# EasyEDA Pro project ProProject_Access Control AC Power Switch_2024-06-07.epro, schematic V2.0.1 Power Relay Schematic
Create Date: 2024-05-01; Page Name: P1; Project Name: Access Control V2; Schematic Name: V2.0.1 Power Relay Schematic; Update Date: 2024-05-10; Company: EasyEDA.com; Drawn: EasyEDA; Page Size: A4; Part Number: JLCPCB-002; Reviewed: EasyEDA; Version: V0.1
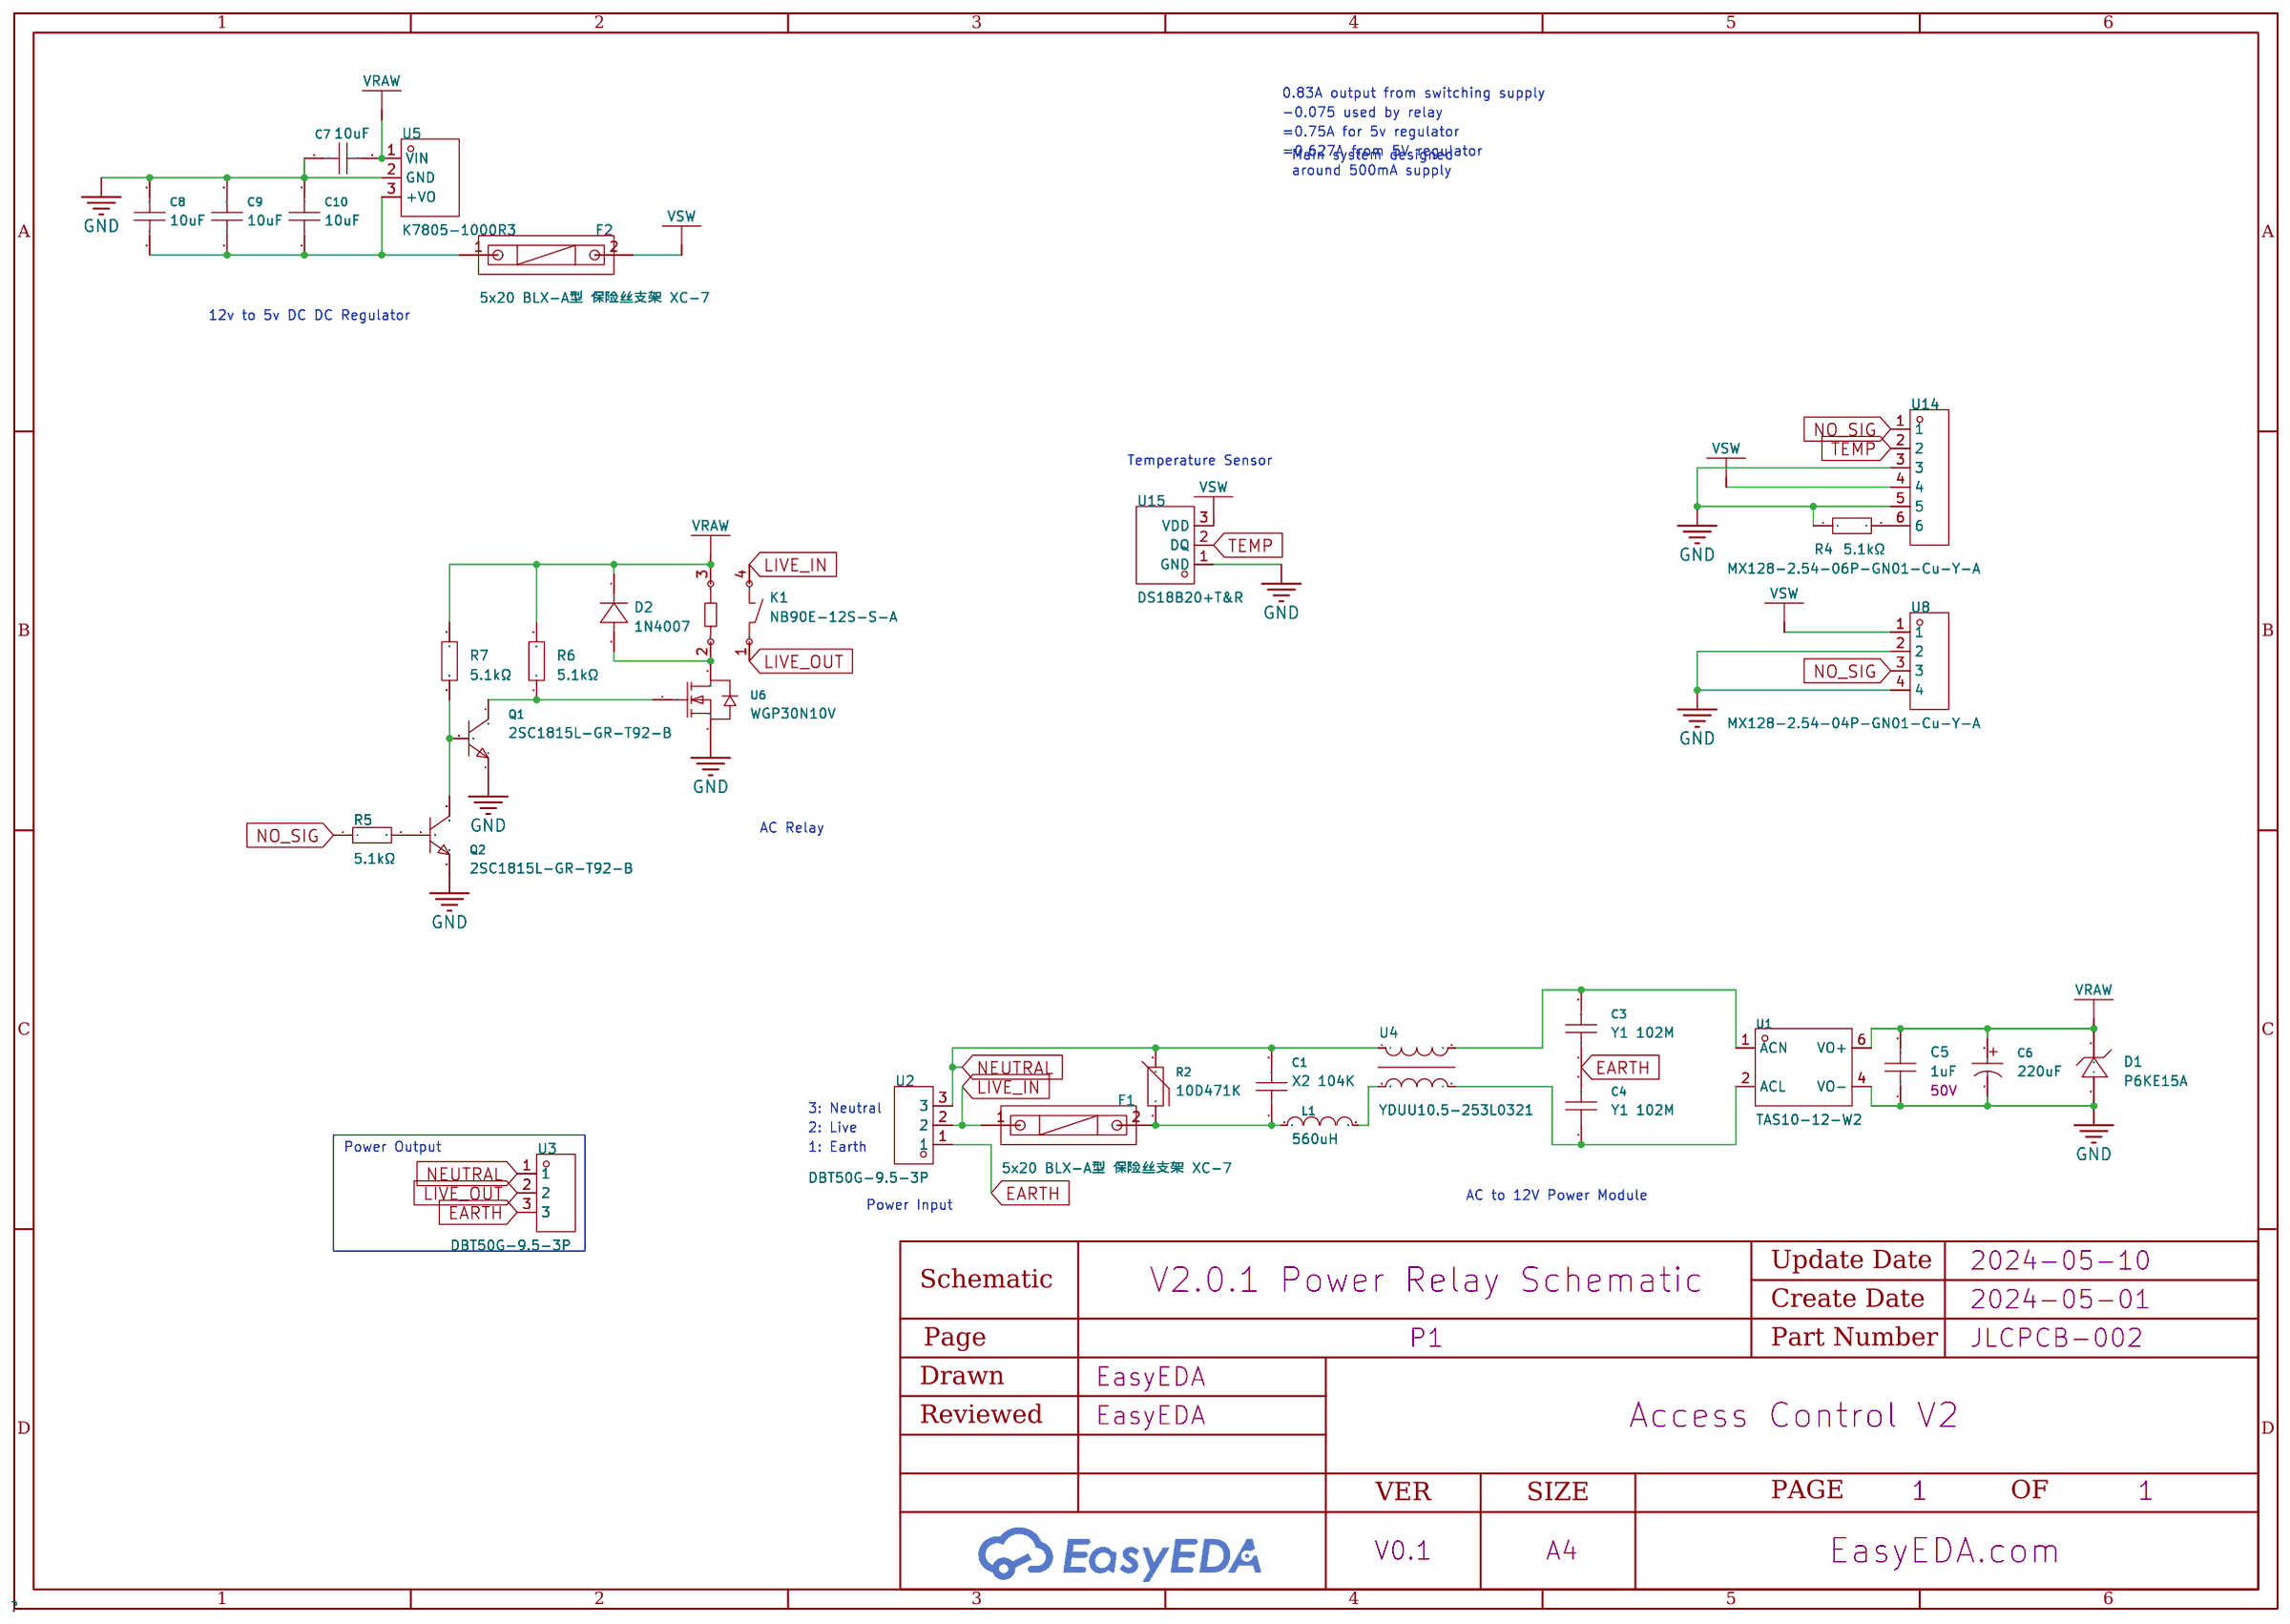
[diagram p0: schematic sheet]

## Parts
C1  100nF  [CAP-TH_L10.0-W5.0-P7.50-D0.6]
C3  1nF  [CAP-TH_L8.5-W5.0-P10.00-D0.6]
C4  1nF  [CAP-TH_L8.5-W5.0-P10.00-D0.6]
C5  1uF  [CAP-TH_L5.5-W3.5-P5.00-D1.2]
C6  220uF  [CAP-TH_BD6.3-P2.50-D1.0-FD]
C7  10uF  [CAP-TH_L5.5-W3.8-P3.50-D0.6]
C8  10uF  [CAP-TH_L5.5-W3.8-P3.50-D0.6]
C9  10uF  [CAP-TH_L5.5-W3.8-P3.50-D0.6]
C10  10uF  [CAP-TH_L5.5-W3.8-P3.50-D0.6]
D1  P6KE15A  [DO-15_BD3.2-L6.4-P10.40-D0.8-RD]
D2  1N4007  [DO-41_BD2.4-L4.7-P8.70-D0.8-RD]
F1  5x20 BLX-A型 保险丝支架 XC-7  [FUSE-TH_L22.6-W9.0]
F2  5x20 BLX-A型 保险丝支架 XC-7  [FUSE-TH_L22.6-W9.0]
K1  NB90E-12S-S-A  [RELAY-TH_NB90E-XXS-S-A]
L1  560uH  [IND-TH_BD9.0-P5.00-D0.7]
Q1  2SC1815L-GR-T92-B  [TO-92-3_L4.9-W3.7-P2.54-L]
Q2  2SC1815L-GR-T92-B  [TO-92-3_L4.9-W3.7-P2.54-L]
R2  10D471K  [RES-TH_L12.5-W6.7-P7.50-D1.2]
R4  5.1kΩ  [RES-TH_BD2.3-L6.5-P10.50-D0.5]
R5  5.1kΩ  [RES-TH_BD2.3-L6.5-P10.50-D0.5]
R6  5.1kΩ  [RES-TH_BD2.3-L6.5-P10.50-D0.5]
R7  5.1kΩ  [RES-TH_BD2.3-L6.5-P10.50-D0.5]
U1  TAS10-12-W2  [PWRM-TH_TAS10-XX-W2]
U2  DBT50G-9.5-3P  [CONN-TH_3P-P9.50_DBT50G-9.5-3P]
U3  DBT50G-9.5-3P  [CONN-TH_3P-P9.50_DBT50G-9.5-3P]
U4  YDUU10.5-253L0321  [IND-TH_4P-L19.0-W17.0]
U5  K7805-1000R3  [PWRM-TH_YLPTEC_K78XX-1000R3]
U6  WGP30N10V  [TO-220-3_L10.0-W4.6-P2.54-L]
U8  MX128-2.54-04P-GN01-Cu-Y-A  [CONN-TH_4P-P2.54_MX128-2.54-GN01-04P-CU-Y-A]
U14  MX128-2.54-06P-GN01-Cu-Y-A  [CONN-TH_6P-P2.54_MX128-2.54-6P]
U15  DS18B20+T&R  [TO-92-3_L4.9-W3.7-P2.54-L]

## Library data of the parts
C1 = PX104K2C0702: Capacitance: Tolerance:±10% Tolerance:±10% Voltage(AC):310V；380V；350V Subclass: Operating Temperature:-40℃~+110℃ Operating Temperature:-40℃~+110℃; LCSC Part Name: 等级:X2 100nF ±10% 310V 350V 380V; Supplier Part: C2693793; Manufacturer: KYET(科雅); Supplier Footprint: 插件,P=7.5mm; JLCPCB Part Class: Extended Part; Datasheet: https://atta.szlcsc.com/upload/public/pdf/source/20230824/212A883DA7F3524E26A294E17BC5A0F4.pdf; Supplier: LCSC; Tolerance: ±10%; Voltage(AC): 310V；380V；350V; Operating Temperature: -40℃~+110℃
C3 C4 = VY1102M31Y5UC63V0: Capacitance: Tolerance:±20% Tolerance:±20% Voltage(AC):760V Subclass: Operating Temperature:-40℃~+125℃ Operating Temperature:-40℃~+125℃; LCSC Part Name: 等级:X1,Y1 1nF ±20% 760V; Supplier Part: C1620957; Manufacturer: VISHAY(威世); Supplier Footprint: 插件,P=10mm; JLCPCB Part Class: Extended Part; Datasheet: https://atta.szlcsc.com/upload/public/pdf/source/20210503/4C6D9DFEC0766624DBEA7F26F929BB18.pdf; Supplier: LCSC; Tolerance: ±20%; Voltage(AC): 760V; Operating Temperature: -40℃~+125℃
C5 = FK26X7R1H105KRE06: Capacitance: Tolerance:±10% Tolerance:±10% Voltage Rated: Lead Spacing: Temperature Coefficient:; LCSC Part Name: 1uF ±10% 50V; Supplier Part: C2839237; Manufacturer: TDK; Supplier Footprint: 插件,P=5mm; JLCPCB Part Class: Extended Part; Datasheet: https://atta.szlcsc.com/upload/public/pdf/source/20211011/CA0C243CD946D294CDFF83D03DB16AD9.pdf; Supplier: LCSC; Tolerance: ±10%; Voltage Rated: 50V
C6 = KM227M025E11RR0VH2FP0: Capacitance:220uF Tolerance:±20% Tolerance:±20% Rated Voltage: Ripple Current:- Equivalent Series Resistance(ESR):- Lead Spacing: φD: L: Lifetime @ Temp:1000hrs@105℃; LCSC Part Name: 220uF ±20% 25V; Supplier Part: C12450; Manufacturer: CX(承兴); Supplier Footprint: 插件,D6.3xL11mm; JLCPCB Part Class: Extended Part; Datasheet: https://atta.szlcsc.com/upload/public/pdf/source/20211027/06D6BA3719C264B639DC286D935D03EA.pdf; Supplier: LCSC; Tolerance: ±20%; Lifetime @ Temp: 1000hrs@105℃
C7-C10 = CD1E106MC9BER2F100: Capacitance:10uF Tolerance:±20% Tolerance:±20% Voltage Rated: Temperature Coefficient:; LCSC Part Name: 10uF ±20% 25V; Supplier Part: C2761733; Manufacturer: Dersonic(德尔创); Supplier Footprint: 插件,P=5.08mm; JLCPCB Part Class: Extended Part; Datasheet: https://atta.szlcsc.com/upload/public/pdf/source/20210512/C2761733_48A4F8FFA54EF14BEC181E01EC41507A.pdf; Supplier: LCSC; Tolerance: ±20%
D1 = P6KE15A_C1974865: polarity:Unidirectional Reverse Stand-Off Voltage (Vrwm):12.8V Maximum Clamping Voltage:21.2V Peak Pulse Current (Ipp)@10/1000us:28.8A Peak Pulse Power Dissipation (Ppp)@10/1000us:600W Breakdown Voltage:14.3V Type:TVS; LCSC Part Name: TVS 12.8V截止 28.8A峰值脉冲; Supplier Part: C1974865; Manufacturer: Littelfuse(美国力特); Supplier Footprint: DO-15(DO-204AC); JLCPCB Part Class: Extended Part; Datasheet: https://atta.szlcsc.com/upload/public/pdf/source/20210316/C2760121_CE745CC1535F4E7F6CA9D58EF9C8652B.pdf; Supplier: LCSC; polarity: Unidirectional; Reverse Stand-Off Voltage (Vrwm): 12.8V; Maximum Clamping Voltage: 21.2V; Peak Pulse Current (Ipp)@10/1000us: 28.8A; Peak Pulse Power Dissipation (Ppp)@10/1000us: 600W; Breakdown Voltage: 14.3V; Type: TVS
D2 = 1N4007_C2985028: Forward Voltage (Vf@If):1V@1A Reverse Voltage (Vr): Average Rectified Current (Io):; LCSC Part Name: 电压:1kV 电流:1A; Supplier Part: C2985028; Manufacturer: GOODWORK(固得沃克); Supplier Footprint: DO-41; JLCPCB Part Class: Extended Part; Datasheet: https://atta.szlcsc.com/upload/public/pdf/source/20210723/C2848669_ECFE0BC1B34B7BAAA686846FF0F306A7.pdf; Supplier: LCSC; Forward Voltage (Vf@If): 1V@1A
F1 F2 = 5x20 BLX-A型 保险丝支架 XC-7: Fuseholder Type:- Fuse Type:- Fuse Size:-; LCSC Part Name: 保险丝座 5x20 BLX-A型; Supplier Part: C3131; Manufacturer: xcfuse(旭程); JLCPCB Part Class: Extended Part; Datasheet: https://atta.szlcsc.com/upload/public/pdf/source/20160427/1461725215151.pdf; Supplier: LCSC
K1 = NB90E-12S-S-A: Coil Voltage:12V Contact Form:一组常开:1A(SPST-常开) Pin Number:- Contact Rating:- Maximum Switching Voltage:277V@AC；30V@DC Coil Rated Power:900mW Contact Material:AgSnO2 Maximum Switching Current:30A Coil Type:无极性-单线圈 Coil Resistance:160Ω Contact Resistance:10; LCSC Part Name: 12V继电器 单刀单掷-常开; Supplier Part: C396894; Manufacturer: NBC(宝橙); Supplier Footprint: 插件,27.2x32mm; JLCPCB Part Class: Extended Part; Datasheet: https://atta.szlcsc.com/upload/public/pdf/source/20190621/C396896_7BA89285BD2A8229CEB67C9FBB667B77.pdf; Supplier: LCSC; Coil Voltage: 12V; Contact Form: 一组常开:1A(SPST-常开); Maximum Switching Voltage: 277V@AC；30V@DC; Coil Rated Power: 900mW; Contact Material: AgSnO2; Maximum Switching Current: 30A; Coil Type: 无极性-单线圈; Coil Resistance: 160Ω; Contact Resistance: 100mΩ; Operate Time: 15ms; Release Time: 10ms; Operating Temperature: -55℃~+85℃
L1 = PK0810-561KB: Inductance: Tolerance:±10% Tolerance:±10% Rated Current: DC Resistance (DCR): Type:工字电感; LCSC Part Name: 560uH ±10%; Supplier Part: C122800; Manufacturer: SXN(顺翔诺); Supplier Footprint: 插件; JLCPCB Part Class: Extended Part; Datasheet: https://atta.szlcsc.com/upload/public/pdf/source/20210810/BA6D1DA7D4BCBB7C641BC97B42CFC6FF.pdf; Supplier: LCSC; Tolerance: ±10%; Type: 工字电感
Q1 Q2 = 2SC1815L-GR-T92-B: Transistor Type: Collector Current (Ic): Collector-Emitter Breakdown Voltage (Vceo): Power Dissipation (Pd):; LCSC Part Name: 耐压:50V 电流:150mA NPN hfe=200~400; Supplier Part: C73309; Manufacturer: UTC(友顺); Supplier Footprint: TO-92-2.54mm; JLCPCB Part Class: Extended Part; Datasheet: https://atta.szlcsc.com/upload/public/pdf/source/20170209/1486607344255.pdf; Supplier: LCSC
R2 = 10D471K_C8760: Varistor Voltage:423V~517V Varistor Voltage:423V~517V Clamping Voltage: Allowable Voltage (DC): Allowable Voltage (AC): Peak Current: Maximum Energy:42.3J Maximum Energy:42.3J Typical Capatitance:190pF@1kHz; LCSC Part Name: 钳位电压775V 42.3焦耳 插件压敏电阻; Supplier Part: C8760; Manufacturer: RUILON(瑞隆源); Supplier Footprint: 插件; JLCPCB Part Class: Extended Part; Datasheet: https://atta.szlcsc.com/upload/public/pdf/source/20160725/1469440740918.pdf; Supplier: LCSC; Varistor Voltage: 423V~517V; Maximum Energy: 42.3J; Typical Capatitance: 190pF@1kHz
R4-R7 = CF1/4W-5.1KΩ±5% T: Type:Carbon Resister Resistance: Tolerance:±5% Tolerance:±5% Overload Voltage (Max):250V Power(Watts):250mW Temperature Coefficient:±350ppm/℃ Temperature Coefficient:±350ppm/℃ Operating Temperature Range:-55℃~+155℃ Operating Temperature Range:-55℃~+155℃; LCSC Part Name: 5.1kΩ ±5% 250mW 碳膜电阻; Supplier Part: C120072; Manufacturer: CCO(千志电子); Supplier Footprint: 插件,D2.3xL6.5mm; JLCPCB Part Class: Extended Part; Datasheet: https://atta.szlcsc.com/upload/public/pdf/source/20190910/C427328_A0A2D65F3FD547937F4E674C90868175.pdf; Supplier: LCSC; Type: Carbon Resister; Tolerance: ±5%; Overload Voltage (Max): 250V; Power(Watts): 250mW; Temperature Coefficient: ±350ppm/℃; Operating Temperature Range: -55℃~+155℃
U1 = TAS10-12-W2: Conversion Type:AC-DC；AC/DC-DC Input Voltage(DC):100V~370V Input Voltage(DC):100V~370V Output Voltage:12V Output Voltage:12V Output Power:10W Input Voltage(AC):85VAC~265VAC Input Voltage(AC):85VAC~265VAC Output Current (Max):830mA Output Current (Max):830; Supplier Part: C2687656; Manufacturer: TDPOWER(腾达电源); Supplier Footprint: 插件,25x39mm; JLCPCB Part Class: Extended Part; Datasheet: https://atta.szlcsc.com/upload/public/pdf/source/20210914/95F169B7B21081D929A6CFE8A15609A6.pdf; Supplier: LCSC; Conversion Type: AC-DC；AC/DC-DC; Input Voltage(DC): 100V~370V; Output Voltage: 12V; Output Power: 10W; Input Voltage(AC): 85VAC~265VAC; Output Current (Max): 830mA; Function: 降压型; Isolation or not: 隔离; Output Channel: 1; Insulated Voltage: 2.5kV@AC; Conversion Efficiency: 85%; Feature: Overcurrent Protection；短路保护自恢复
U2 U3 = DBT50G-9.5-3P: Barrier Type:带盖板 Pitch:9.5mm Structure:1x3P Mounting Style:直针 Pin Location:边脚 Number of Pins:3P Number of Rows:1 Current Rating (Max):32A Voltage Rating (Max):750V Wire Gauge - AWG:12~22 Wire Gauge - mm2:4 Operating Temperature Range:-40℃~+105℃ Operating; LCSC Part Name: 9.5mm 1x3P 每排P数:3 排数:1 直针 边脚; Supplier Part: C395959; Manufacturer: DORABO(地博电气); Supplier Footprint: 插件,P=9.5mm; JLCPCB Part Class: Extended Part; Datasheet: https://atta.szlcsc.com/upload/public/pdf/source/20221019/84C53DE9D8912EDE417B2211EE296996.pdf; Supplier: LCSC; Barrier Type: 带盖板; Pitch: 9.5mm; Structure: 1x3P; Mounting Style: 直针; Pin Location: 边脚; Number of Pins: 3P; Number of Rows: 1; Current Rating (Max): 32A; Voltage Rating (Max): 750V; Wire Gauge - AWG: 12~22; Wire Gauge - mm2: 4; Operating Temperature Range: -40℃~+105℃; Color: Black; Number of PINs Per Row: 3
U4 = YDUU10.5-253L0321: Number of Lines:2 Withstanding Voltage:1.5kV@AC Inductance @ Frequency:25mH@1KHz; LCSC Part Name: UU10.5 25mH @1KHz; Supplier Part: C5200263; Manufacturer: YJYCOIN(益嘉源); Supplier Footprint: 插件,19x17x22mm; JLCPCB Part Class: Extended Part; Datasheet: https://atta.szlcsc.com/upload/public/pdf/source/20221019/CF3EF2D4E89C9F1A1EF6A77931981DBC.pdf; Supplier: LCSC; Number of Lines: 2; Withstanding Voltage: 1.5kV@AC; Inductance @ Frequency: 25mH@1KHz
U5 = K7805-1000R3: Conversion Type:DC-DC Input Voltage(DC):8V~36V Input Voltage(DC):8V~36V Output Voltage:5V Output Voltage:5V Output Power:5W Output Current (Max):1A Output Current (Max):1A Function:升降压型 Isolation or not:非隔离 Output Channel:1 Insulated Voltage:- Conversion; LCSC Part Name: DC-DC 输入电压8V~36V 输出电压5V输出功率5W1000mA; Supplier Part: C2992391; Manufacturer: YLPTEC(易川); Supplier Footprint: 插件; JLCPCB Part Class: Extended Part; Datasheet: https://atta.szlcsc.com/upload/public/pdf/source/20220510/13042FEFCE8A01FC3BA968F60B4D6D28.pdf; Supplier: LCSC; Conversion Type: DC-DC; Input Voltage(DC): 8V~36V; Output Voltage: 5V; Output Power: 5W; Output Current (Max): 1A; Function: 升降压型; Isolation or not: 非隔离; Output Channel: 1; Conversion Efficiency: 93%; Feature: Short-Circuit Protection；Low-Power Consumption; Maximum Capacitive Load: 680uF
U6 = WGP30N10V: Type:1个NChannel Drain Source Voltage (Vdss): Continuous Drain Current (Id): Power Dissipation (Pd): Drain Source On Resistance (RDS(on)@Vgs,Id):36mΩ@10V,; LCSC Part Name: 1个N沟道 耐压:100V 电流:30A; Supplier Part: C17702381; Manufacturer: Wild Goose(威谷); Supplier Footprint: TO-220; Datasheet: https://atta.szlcsc.com/upload/public/pdf/source/20230915/178B7459ABA4E98915C1CC177AA9479D.pdf; Supplier: LCSC; Type: 1个NChannel; Drain Source On Resistance (RDS(on)@Vgs,Id): 36mΩ@10V,
U8 = MX128-2.54-04P-GN01-Cu-Y-A: Structure:1x4P Pitch:2.54mm Color:Green Mounting Style:Straight Current Rating (Max):6A Voltage Rating (Max):150V Number of Pins:4P Number of Rows:1 Wire Gauge - AWG:18~24 Wire Gauge - AWG:18~24 Wire Gauge - mm2:1 Wire Gauge - mm2:1 Number of PINs Per Row; LCSC Part Name: 2.54mm 1x4P 排数:1 每排P数:4 直插; Supplier Part: C5188444; Manufacturer: MAX(迈旭); Supplier Footprint: 插件,P=2.54mm; JLCPCB Part Class: Extended Part; Datasheet: https://atta.szlcsc.com/upload/public/pdf/source/20230914/7C75AD31AD41EB9EF855A76DB002C0D2.pdf; Supplier: LCSC; Structure: 1x4P; Pitch: 2.54mm; Color: Green; Mounting Style: Straight; Current Rating (Max): 6A; Voltage Rating (Max): 150V; Number of Pins: 4P; Number of Rows: 1; Wire Gauge - AWG: 18~24; Wire Gauge - mm2: 1; Number of PINs Per Row: 4; Contact Material: Copper Alloy; Contact Plating: Tin; Operating Temperature Range: -40℃~+105℃
U14 = MX128-2.54-06P-GN01-Cu-Y-A: Structure:1x6P Pitch:2.54mm Color:Green Mounting Style:Straight Current Rating (Max):6A Voltage Rating (Max):150V Number of Pins:6P Number of Rows:1 Wire Gauge - AWG:18~24 Wire Gauge - AWG:18~24 Wire Gauge - mm2:1 Wire Gauge - mm2:1 Number of PINs Per Row; LCSC Part Name: 2.54mm 1x6P 排数:1 每排P数:6 直插; Supplier Part: C5188446; Manufacturer: MAX(迈旭); Supplier Footprint: 插件,P=2.54mm; JLCPCB Part Class: Extended Part; Datasheet: https://atta.szlcsc.com/upload/public/pdf/source/20230914/7C75AD31AD41EB9EF855A76DB002C0D2.pdf; Supplier: LCSC; Structure: 1x6P; Pitch: 2.54mm; Color: Green; Mounting Style: Straight; Current Rating (Max): 6A; Voltage Rating (Max): 150V; Number of Pins: 6P; Number of Rows: 1; Wire Gauge - AWG: 18~24; Wire Gauge - mm2: 1; Number of PINs Per Row: 6; Contact Material: Copper Alloy; Contact Plating: Tin; Operating Temperature Range: -40℃~+105℃
U15 = DS18B20+T&R: Supply Voltage:3V~5.5V Supply Voltage:3V~5.5V; Supplier Part: C880672; Manufacturer: ADI(亚德诺)/MAXIM(美信); Supplier Footprint: TO-92; JLCPCB Part Class: Extended Part; Datasheet: https://atta.szlcsc.com/upload/public/pdf/source/20201223/C880672_EEBB787AABBE3FE11FE7BE07B2E2EC5E.pdf; Supplier: LCSC; Supply Voltage: 3V~5.5V

## Nets
GND: C5.1 C6.2 C7.2 C8.2 C9.2 C10.2 D1.2(A) Q1.1(E) Q2.1(E) R4.1 U1.4(VO-) U5.2(GND) U6.3(S) U8.2 U8.4 U14.3 U14.5 U15.1(GND)
EARTH: C3.1 C4.2 U2.1 U3.3
LIVE_IN: F1.1 K1.4 U2.2
LIVE_OUT: K1.1 U3.2
NEUTRAL: C1.2 R2.2 U2.3 U3.1 U4.4
NO_SIG: R5.1 U8.3 U14.1
TEMP: U14.2 U15.2(DQ)
VRAW: C5.2 C6.1 C7.1 D1.1(C) D2.1(K) K1.3 R6.2 R7.2 U1.6(VO+) U5.1(VIN)
VSW: F2.2 U8.1 U14.4 U15.3(VDD)
$1N1267: C1.1 F1.2 L1.1 R2.1
$1N2210: C8.1 C9.1 C10.1 F2.1 U5.3(+VO)
$1N2775: D2.2(A) K1.2 U6.2(D)
$1N2784: Q1.2(C) R6.1 U6.1(G)
$1N3014: Q1.3(B) Q2.2(C) R7.1
$1N3022: Q2.3(B) R5.2
$1N3091: L1.2 U4.3
$1N3100: C3.2 U1.1(ACN) U4.2
$1N3107: C4.1 U1.2(ACL) U4.1
$1N5095: R4.2 U14.6

## Notes on the sheet
- 0.83A output from switching supply
- -0.075 used by relay
- =0.627A from 5V regulator
- =0.75A for 5v regulator
- Main system designed
  around 500mA supply
- 12v to 5v DC DC Regulator
- Temperature Sensor
- AC Relay
- 3: Neutral
- 2: Live
- Power Output
- 1: Earth
- Power Input
- AC to 12V Power Module
